# EAGLE schematic FlightPCB (EAGLE 9.5.2)
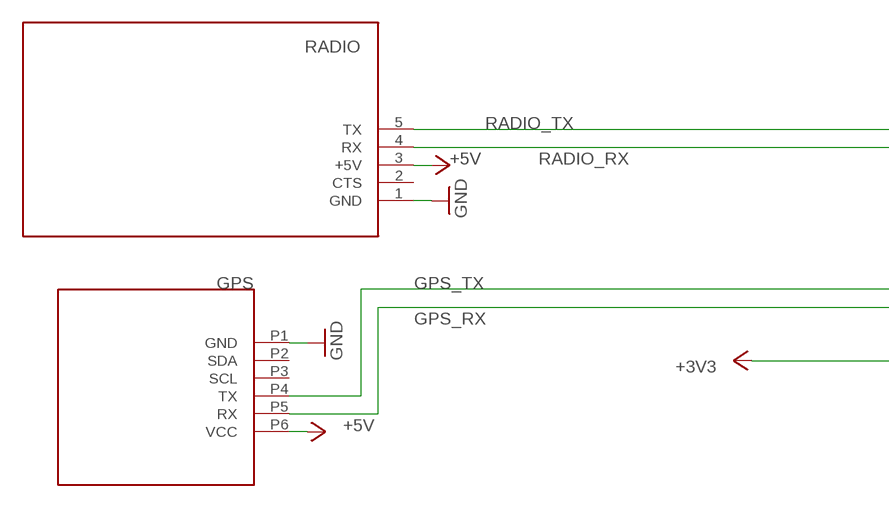
[diagram p0: schematic, sheet 1, part 1 of 2]
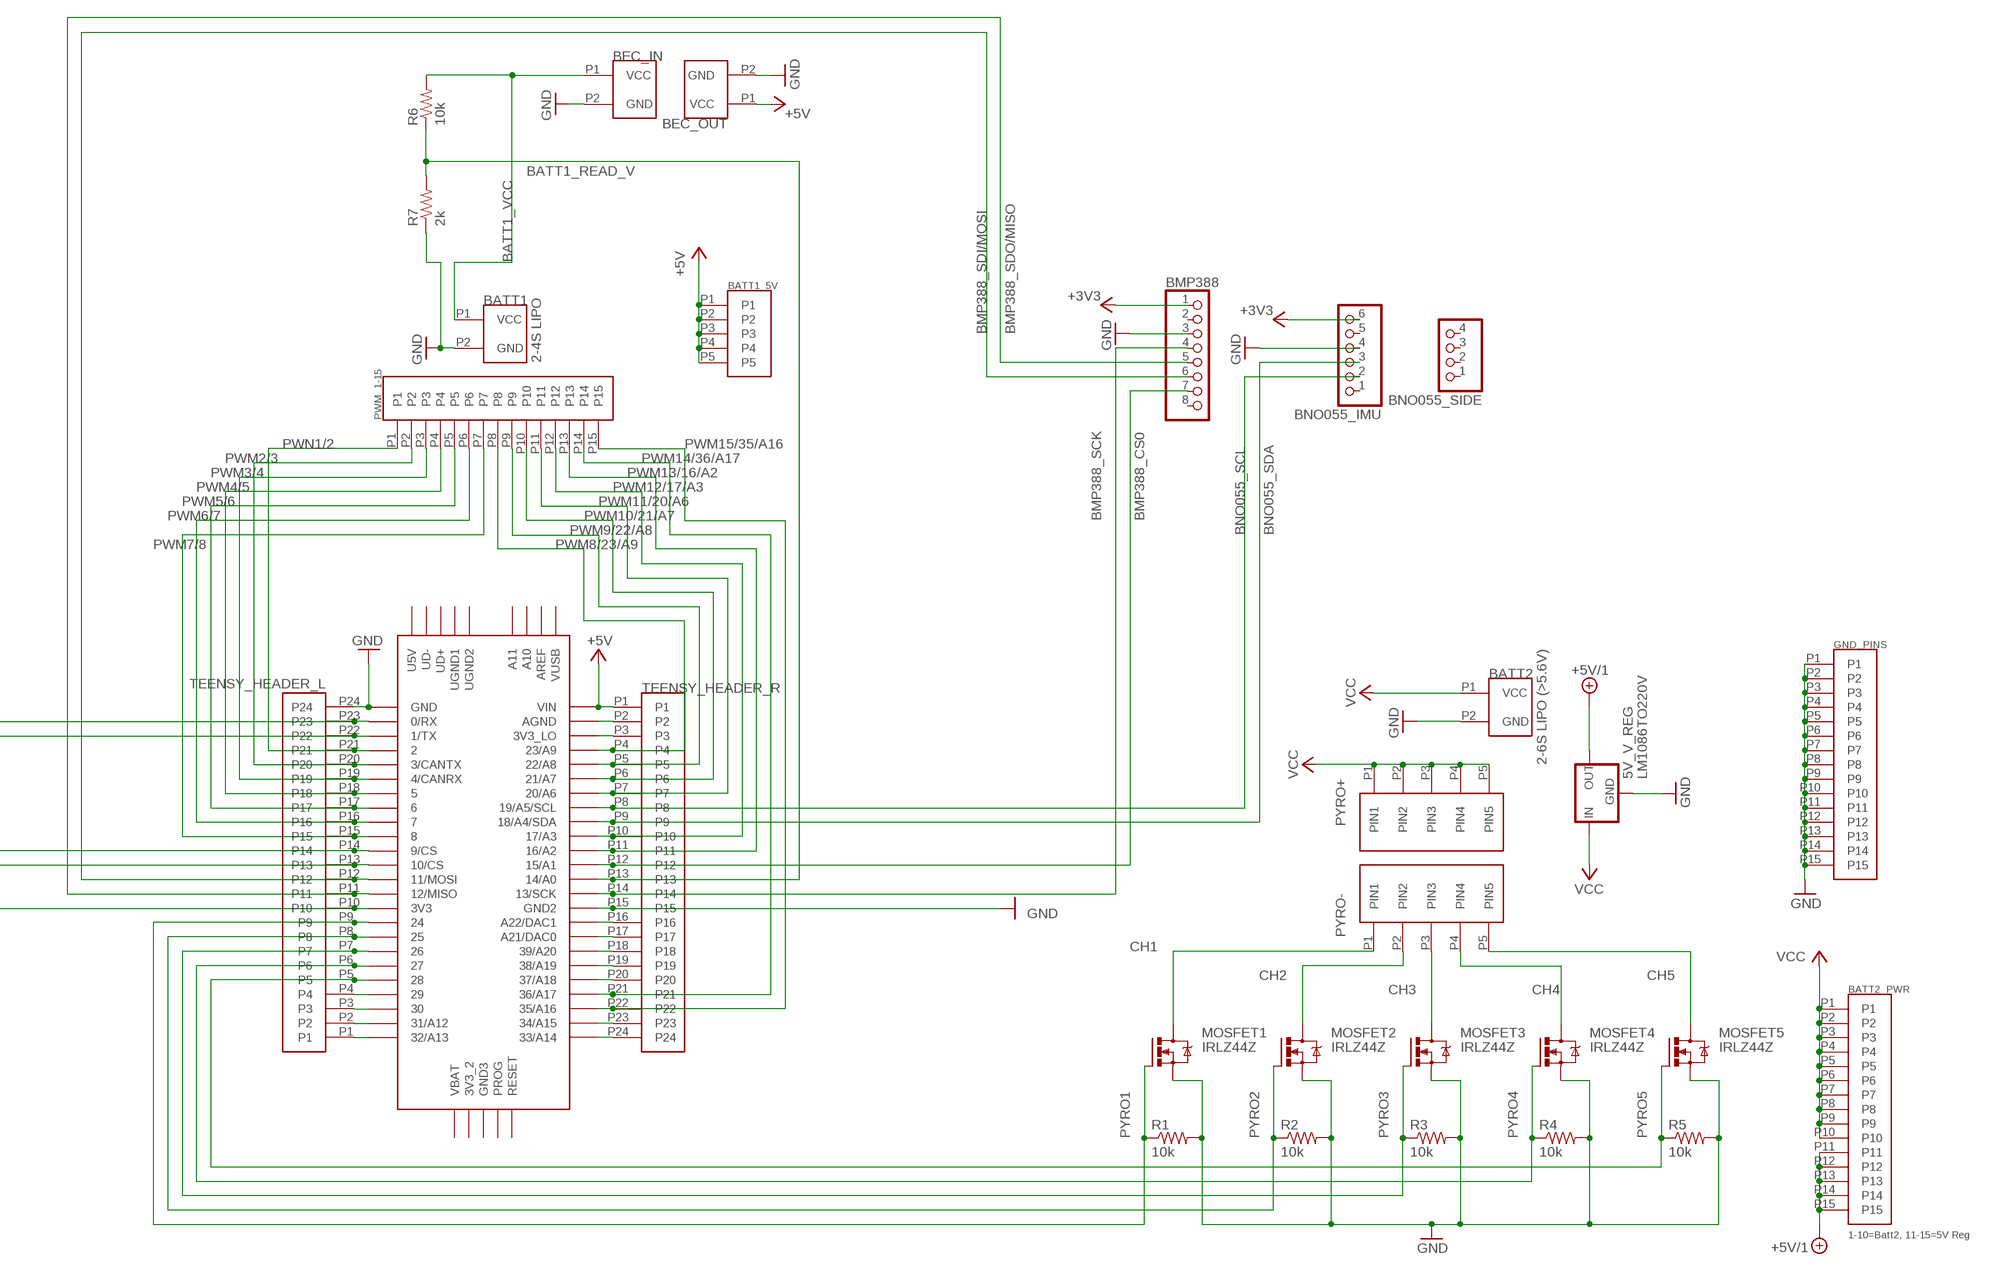
[diagram p1: schematic, sheet 1, part 2 of 2]

## Parts
5V_V_REG  LM1086TO220V  [TO220S]
BATT1  2-4S LIPO  TERMINAL_BLOCK_2_PIN_5MM  [TERMINAL_BLOCK_2_PIN_5MM]
BATT1_5V  PIN_HEADER_5  [PIN_HEADER_5]
BATT2  2-6S LIPO (>5.6V)  TERMINAL_BLOCK_2_PIN_5MM  [TERMINAL_BLOCK_2_PIN_5MM]
BATT2_PWR  1-10=Batt2, 11-15=5V Reg  PIN_HEADER_15  [PIN_HEADER_15]
BEC_IN  TERMINAL_BLOCK_2_PIN_5MM  [TERMINAL_BLOCK_2_PIN_5MM]
BEC_OUT  TERMINAL_BLOCK_2_PIN_5MM  [TERMINAL_BLOCK_2_PIN_5MM]
BMP388  MICROBUILDER_HEADER-1X8ROUND  [MICROBUILDER_1X08_ROUND]
BNO055_IMU  MICROBUILDER_HEADER-1X6ROUND  [MICROBUILDER_1X06_ROUND]
BNO055_SIDE  MICROBUILDER_HEADER-1X4ROUND  [MICROBUILDER_1X04_ROUND]
FLIGHT_COMPUTER  TEENSY_3.5/3.6  [TEENSY_3.5/3.6]
GND_PINS  PIN_HEADER_15  [PIN_HEADER_15]
GPS  NEO_M8N_GPS_BREAKOUT  [NEO_M8N_GPS_BREAKOUT]
MOSFET1  IRLZ44Z  [TO220BH_SIMPLE]
MOSFET2  IRLZ44Z  [TO220BH_SIMPLE]
MOSFET3  IRLZ44Z  [TO220BH_SIMPLE]
MOSFET4  IRLZ44Z  [TO220BH_SIMPLE]
MOSFET5  IRLZ44Z  [TO220BH_SIMPLE]
PWM_1-15  PIN_HEADER_15  [PIN_HEADER_15]
PYRO+  TERMINAL_BLOCK_5_PIN_5MM  [TERMINAL_BLOCK_5_PIN_5MM]
PYRO-  TERMINAL_BLOCK_5_PIN_5MM  [TERMINAL_BLOCK_5_PIN_5MM]
R1  10k  R-US_0204/7  [0204/7]
R2  10k  R-US_0204/7  [0204/7]
R3  10k  R-US_0204/7  [0204/7]
R4  10k  R-US_0204/7  [0204/7]
R5  10k  R-US_0204/7  [0204/7]
R6  10k  R-US_0204/7  [0204/7]
R7  2k  R-US_0204/7  [0204/7]
RADIO  RFD900  [RFD900]
TEENSY_HEADER_L  PIN_HEADER_24_TEENSY_RAIL  [PIN_HEADER_24_TEENSY_RAIL]
TEENSY_HEADER_R  PIN_HEADER_24_TEENSY_RAIL  [PIN_HEADER_24_TEENSY_RAIL]

## Nets
+3V3 [Power Delivery]: BMP388.1 BNO055_IMU.6 FLIGHT_COMPUTER.3V3 TEENSY_HEADER_L.P10
+5V [Power Delivery]: BATT1_5V.P1 BATT1_5V.P2 BATT1_5V.P3 BATT1_5V.P4 BATT1_5V.P5 BEC_OUT.P1(VCC) FLIGHT_COMPUTER.VIN GPS.P6(VCC) RADIO.3(+5V) TEENSY_HEADER_R.P1
+5V/1 [Power Delivery]: 5V_V_REG.2(OUT) BATT2_PWR.P11 BATT2_PWR.P12 BATT2_PWR.P13 BATT2_PWR.P14 BATT2_PWR.P15
BATT1_READ_V: FLIGHT_COMPUTER.14/A0 R6.1 R7.2 TEENSY_HEADER_R.P13
BATT1_VCC [Power Delivery]: BATT1.P1(VCC) BEC_IN.P1(VCC) R6.2
BMP388_CS0: BMP388.7 FLIGHT_COMPUTER.15/A1 TEENSY_HEADER_R.P12
BMP388_SCK: BMP388.4 FLIGHT_COMPUTER.13/SCK TEENSY_HEADER_R.P14
BMP388_SDI/MOSI: BMP388.6 FLIGHT_COMPUTER.11/MOSI TEENSY_HEADER_L.P12
BMP388_SDO/MISO: BMP388.5 FLIGHT_COMPUTER.12/MISO TEENSY_HEADER_L.P11
BNO055_SCL: BNO055_IMU.2 FLIGHT_COMPUTER.19/A5/SCL TEENSY_HEADER_R.P8
BNO055_SDA: BNO055_IMU.3 FLIGHT_COMPUTER.18/A4/SDA TEENSY_HEADER_R.P9
CH1: MOSFET1.D PYRO-.P1(PIN1)
CH2: MOSFET2.D PYRO-.P2(PIN2)
CH3: MOSFET3.D PYRO-.P3(PIN3)
CH4: MOSFET4.D PYRO-.P4(PIN4)
CH5: MOSFET5.D PYRO-.P5(PIN5)
GND [Power Delivery]: 5V_V_REG.1(GND) BATT1.P2(GND) BATT2.P2(GND) BEC_IN.P2(GND) BEC_OUT.P2(GND) BMP388.3 BNO055_IMU.4 FLIGHT_COMPUTER.GND FLIGHT_COMPUTER.GND2 GND_PINS.P1 GND_PINS.P2 GND_PINS.P3 GND_PINS.P4 GND_PINS.P5 GND_PINS.P6 GND_PINS.P7 GND_PINS.P8 GND_PINS.P9 GND_PINS.P10 GND_PINS.P11 GND_PINS.P12 GND_PINS.P13 GND_PINS.P14 GND_PINS.P15 GPS.P1(GND) MOSFET1.S MOSFET2.S MOSFET3.S MOSFET4.S MOSFET5.S R1.2 R2.2 R3.2 R4.2 R5.2 R7.1 RADIO.1(GND) TEENSY_HEADER_L.P24 TEENSY_HEADER_R.P15
GPS_RX: FLIGHT_COMPUTER.10/CS GPS.P5(RX) TEENSY_HEADER_L.P13
GPS_TX: FLIGHT_COMPUTER.9/CS GPS.P4(TX) TEENSY_HEADER_L.P14
N$1: FLIGHT_COMPUTER.AGND TEENSY_HEADER_R.P2
N$2: FLIGHT_COMPUTER.3V3_LO TEENSY_HEADER_R.P3
N$3: FLIGHT_COMPUTER.32/A13 TEENSY_HEADER_L.P1
N$5: FLIGHT_COMPUTER.31/A12 TEENSY_HEADER_L.P2
N$6: FLIGHT_COMPUTER.30 TEENSY_HEADER_L.P3
N$37: FLIGHT_COMPUTER.29 TEENSY_HEADER_L.P4
N$48: FLIGHT_COMPUTER.A22/DAC1 TEENSY_HEADER_R.P16
N$49: FLIGHT_COMPUTER.21/DAC0(A21/DAC0) TEENSY_HEADER_R.P17
N$50: FLIGHT_COMPUTER.39/A20 TEENSY_HEADER_R.P18
N$51: FLIGHT_COMPUTER.38/A19 TEENSY_HEADER_R.P19
N$52: FLIGHT_COMPUTER.37/A18 TEENSY_HEADER_R.P20
N$55: FLIGHT_COMPUTER.34/A15 TEENSY_HEADER_R.P23
N$56: FLIGHT_COMPUTER.33/A14 TEENSY_HEADER_R.P24
PWM2/3: FLIGHT_COMPUTER.3/CANTX PWM_1-15.P2 TEENSY_HEADER_L.P20
PWM3/4: FLIGHT_COMPUTER.4/CANRX PWM_1-15.P3 TEENSY_HEADER_L.P19
PWM4/5: FLIGHT_COMPUTER.5 PWM_1-15.P4 TEENSY_HEADER_L.P18
PWM5/6: FLIGHT_COMPUTER.6 PWM_1-15.P5 TEENSY_HEADER_L.P17
PWM6/7: FLIGHT_COMPUTER.7 PWM_1-15.P6 TEENSY_HEADER_L.P16
PWM7/8: FLIGHT_COMPUTER.8 PWM_1-15.P7 TEENSY_HEADER_L.P15
PWM8/23/A9: FLIGHT_COMPUTER.23/A9 PWM_1-15.P8 TEENSY_HEADER_R.P4
PWM9/22/A8: FLIGHT_COMPUTER.22/A8 PWM_1-15.P9 TEENSY_HEADER_R.P5
PWM10/21/A7: FLIGHT_COMPUTER.21/A7 PWM_1-15.P10 TEENSY_HEADER_R.P6
PWM11/20/A6: FLIGHT_COMPUTER.20/A6 PWM_1-15.P11 TEENSY_HEADER_R.P7
PWM12/17/A3: FLIGHT_COMPUTER.17/A3 PWM_1-15.P12 TEENSY_HEADER_R.P10
PWM13/16/A2: FLIGHT_COMPUTER.16/A2 PWM_1-15.P13 TEENSY_HEADER_R.P11
PWM14/36/A17: FLIGHT_COMPUTER.36/A17 PWM_1-15.P14 TEENSY_HEADER_R.P21
PWM15/35/A16: FLIGHT_COMPUTER.35/A16 PWM_1-15.P15 TEENSY_HEADER_R.P22
PWN1/2: FLIGHT_COMPUTER.2 PWM_1-15.P1 TEENSY_HEADER_L.P21
PYRO1: FLIGHT_COMPUTER.24 MOSFET1.G R1.1 TEENSY_HEADER_L.P9
PYRO2: FLIGHT_COMPUTER.25 MOSFET2.G R2.1 TEENSY_HEADER_L.P8
PYRO3: FLIGHT_COMPUTER.26 MOSFET3.G R3.1 TEENSY_HEADER_L.P7
PYRO4: FLIGHT_COMPUTER.27 MOSFET4.G R4.1 TEENSY_HEADER_L.P6
PYRO5: FLIGHT_COMPUTER.28 MOSFET5.G R5.1 TEENSY_HEADER_L.P5
RADIO_RX: FLIGHT_COMPUTER.1/TX RADIO.4(RX) TEENSY_HEADER_L.P22
RADIO_TX: FLIGHT_COMPUTER.0/RX RADIO.5(TX) TEENSY_HEADER_L.P23
VCC [Power Delivery]: 5V_V_REG.3(IN) BATT2.P1(VCC) BATT2_PWR.P1 BATT2_PWR.P2 BATT2_PWR.P3 BATT2_PWR.P4 BATT2_PWR.P5 BATT2_PWR.P6 BATT2_PWR.P7 BATT2_PWR.P8 BATT2_PWR.P9 BATT2_PWR.P10 PYRO+.P1(PIN1) PYRO+.P2(PIN2) PYRO+.P3(PIN3) PYRO+.P4(PIN4) PYRO+.P5(PIN5)
Unconnected: BMP388.2 BMP388.8 BNO055_IMU.1 BNO055_IMU.5 BNO055_SIDE.1 BNO055_SIDE.2 BNO055_SIDE.3 BNO055_SIDE.4 FLIGHT_COMPUTER.3V3_2 FLIGHT_COMPUTER.A10 FLIGHT_COMPUTER.A11 FLIGHT_COMPUTER.AREF FLIGHT_COMPUTER.GND3 FLIGHT_COMPUTER.PROG FLIGHT_COMPUTER.RESET FLIGHT_COMPUTER.U5V FLIGHT_COMPUTER.UD+ FLIGHT_COMPUTER.UD- FLIGHT_COMPUTER.UGND1 FLIGHT_COMPUTER.UGND2 FLIGHT_COMPUTER.VBAT FLIGHT_COMPUTER.VUSB GPS.P2(SDA) GPS.P3(SCL) RADIO.2(CTS)

## Library data of the parts
5V_V_REG = v-reg-2:LM1086
BATT1 BATT2 BEC_IN BEC_OUT = MattMtzLPRD:TERMINAL_BLOCK_2_PIN_5MM: 2 Pin terminal block, default is VCC and GND for the 2 pins
BATT1_5V = MattMtzLPRD:PIN_HEADER_5: Pin header, 5 pin, .1in/2.54mm spacing
BATT2_PWR GND_PINS PWM_1-15 = MattMtzLPRD:PIN_HEADER_15: Pin Header, 15 Pins
BMP388 = Adafruit BMP388:MICROBUILDER_HEADER-1X8: PIN HEADER
BNO055_IMU = Adafruit BNO055:MICROBUILDER_HEADER-1X6: PIN HEADER
BNO055_SIDE = Adafruit BNO055:MICROBUILDER_HEADER-1X4: PIN HEADER
FLIGHT_COMPUTER = Teensy356:TEENSY_3.5/3.6
GPS = MattMtzLPRD:NEO_M8N_GPS_BREAKOUT: NEO M8N GPS Breakout board. Features 6 pin connection, 4 active, 2 optional
MOSFET1-MOSFET5 = transistor-power_MOD:IRLZ44Z: N-Channel HEXFET® Power MOSFET Logic Level AUTOMOTIVE MOSFET Source: http://www.irf.com/product-info/datasheets/data/irlz44zpbf.pdf
PYRO+ PYRO- = MattMtzLPRD:TERMINAL_BLOCK_5_PIN_5MM: 5 Pin Terminal Block. 5mm spacing
R1-R7 = rcl:R-US_: RESISTOR, American symbol; SPICEPREFIX: R
RADIO = MattMtzLPRD:RFD900: RFD 900+ or x variant 5 pin connection (we currently only need 4 of the 16 available pins)
TEENSY_HEADER_L TEENSY_HEADER_R = MattMtzLPRD:PIN_HEADER_24_TEENSY_RAIL: Pin header, 24 pins, .1in/2.54mm spacing. Works for Teensy 3.6 side rail

## Net classes
1 Power Delivery: width 0.25 mm